# Altium project AGRO_RAK_MK3.PrjPcb
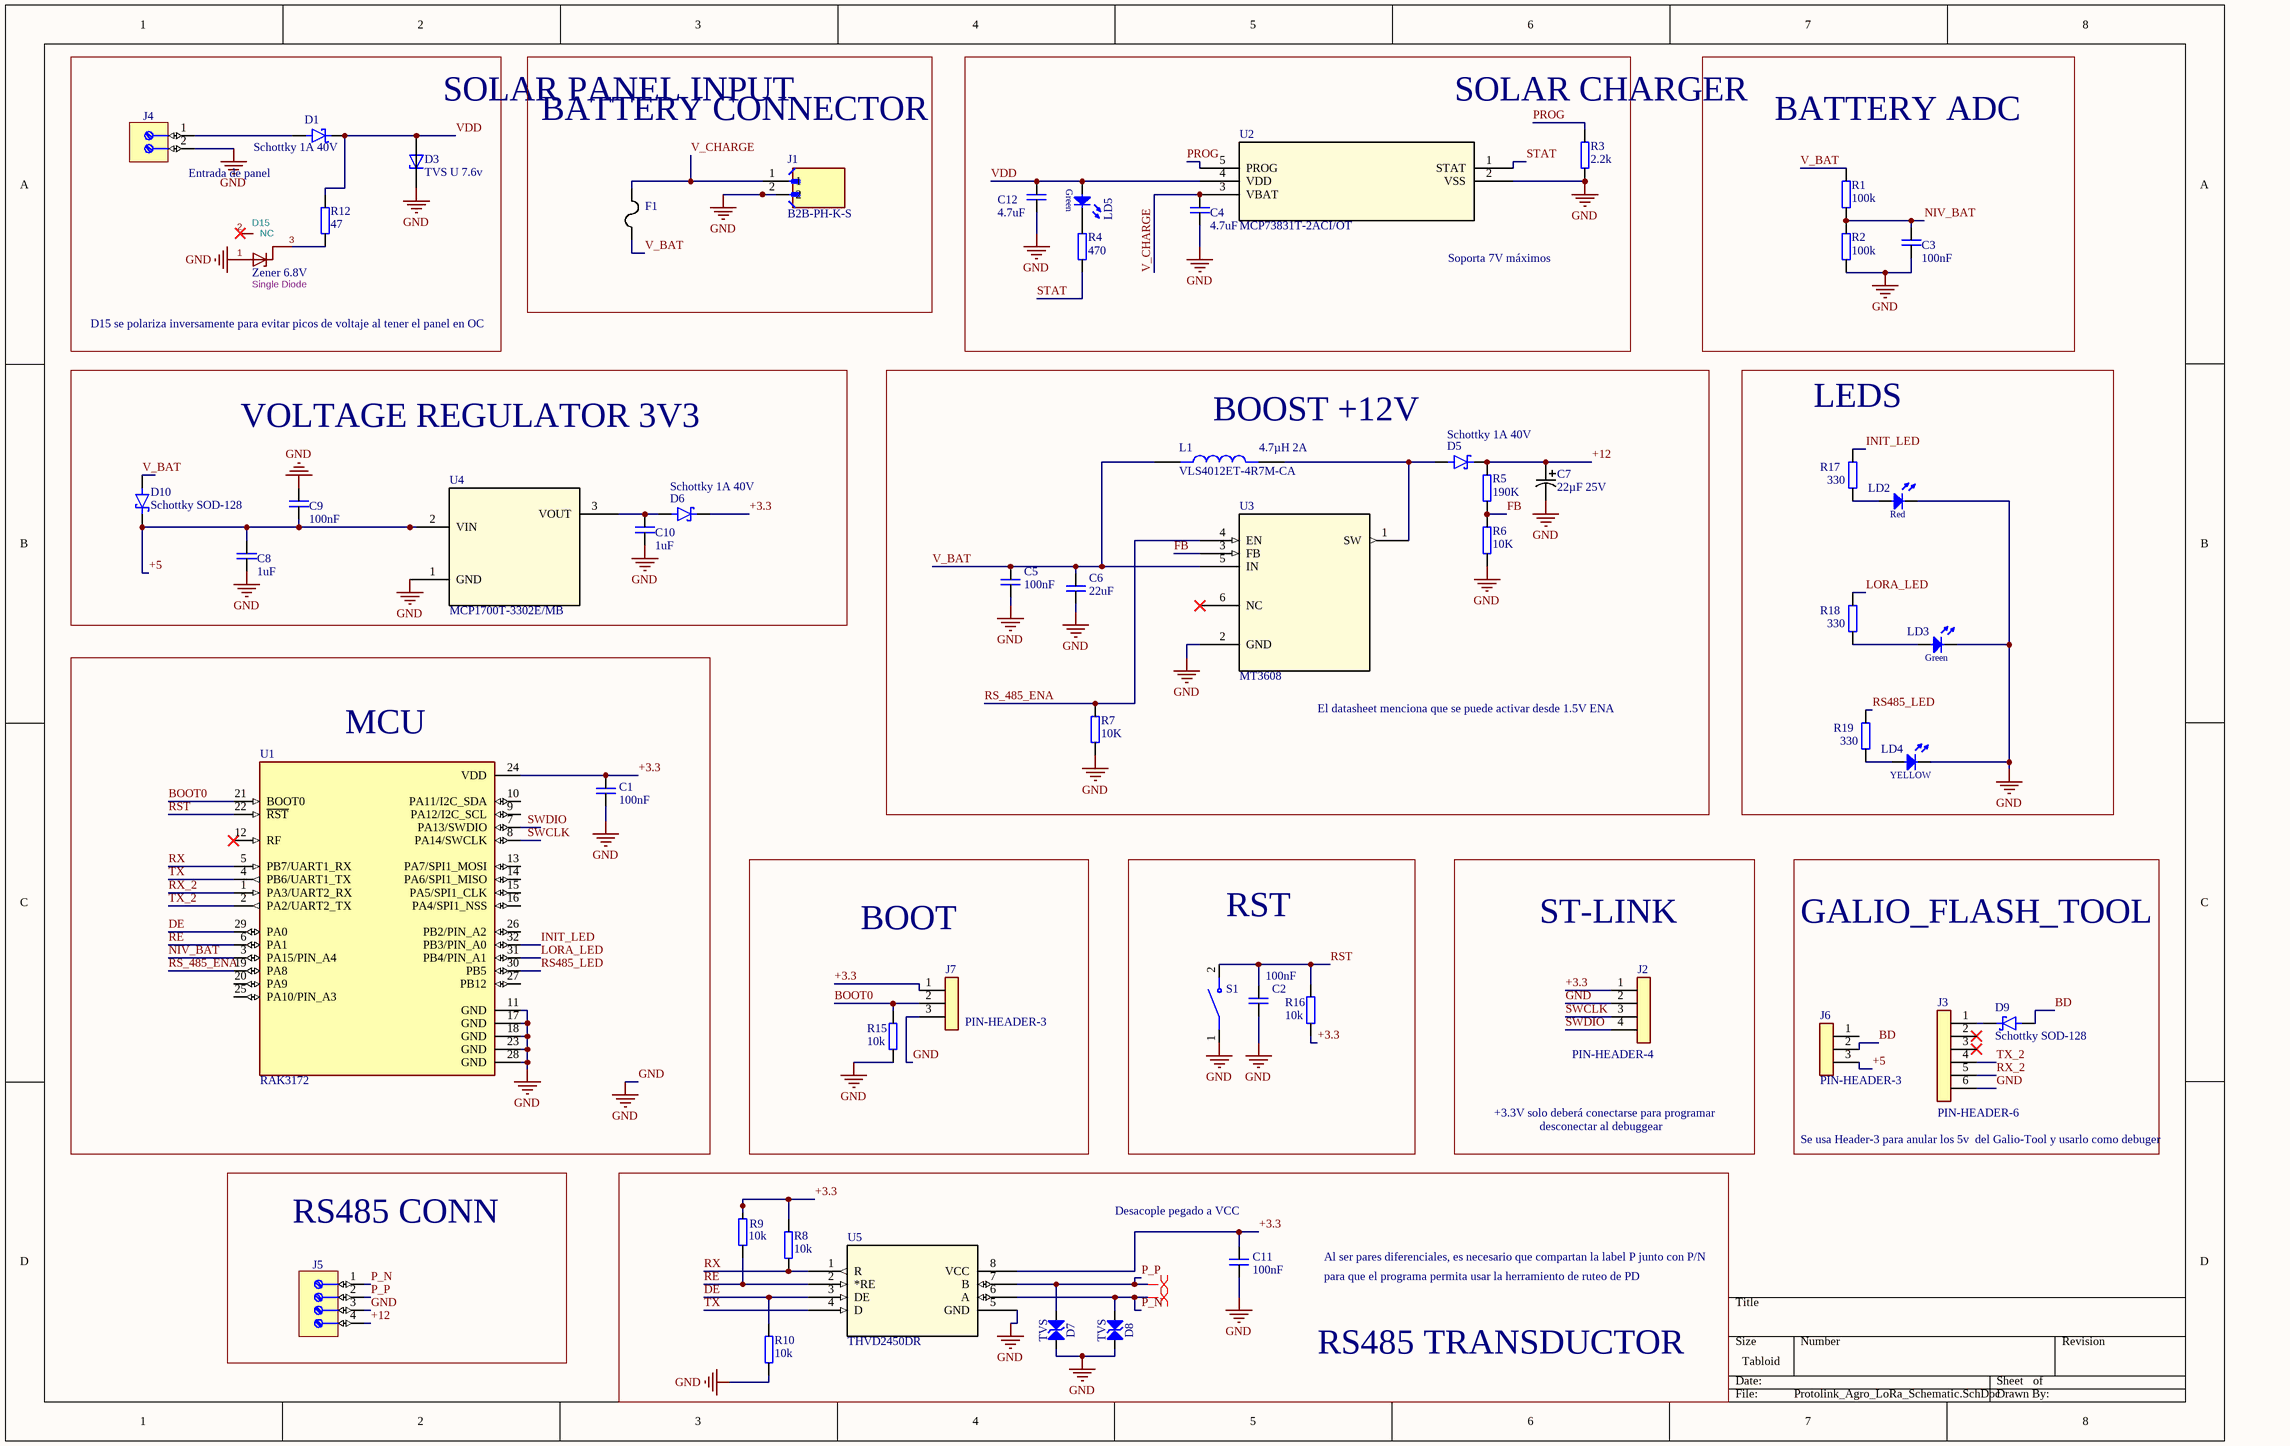
[diagram p0: Protolink_Agro_LoRa_Schematic.SchDoc]
1 sheet, 56 parts. Net scope: global (net labels, ports and power ports of the same name join across sheets).
Board file: Protolink_Agro_LoRa.PcbDoc

## Sheet Protolink_Agro_LoRa_Schematic.SchDoc
size Tabloid; SheetNumber: 1; SheetTotal: 1

### Parts
C1  100nF  [CAPC2012X110N]
C2  100nF  [CAPC2012X110N]
C3  100nF  [CAPC2012X110N]
C4  4.7uF  [CAPC2012X110N]
C5  100nF  [CAPC2012X110N]
C6  22uF  [CAPC2012X110N]
C7  22µF 25V  [CAP_EEFK_C_PAN]
C8  1uF  [CAPC2012X110N]
C9  100nF  [CAPC2012X110N]
C10  1uF  [CAPC2012X110N]
C11  100nF  [CAPC2012X110N]
C12  4.7uF  [CAPC2012X110N]
D1  Schottky 1A 40V  [SODFL4725X110N]
D3  TVS U 7.6v  [DIOM4325X250N]
D5  Schottky 1A 40V  [SODFL4725X110N]
D6  Schottky 1A 40V  [SODFL4725X110N]
D7  TVS  [DIOM5126X229N]
D8  TVS  [DIOM5126X229N]
D9  Schottky SOD-128  [SODFL4725X110N]
D10  Schottky SOD-128  [SODFL4725X110N]
D15  Zener 6.8V  value Single Diode  [SOT-23]
F1  (no value)  [FUSE_MF-MSMF07524-2_BRN]
J1  B2B-PH-K-S  [JST_B2B-PH-K-S]
J2  PIN-HEADER-4  [PIN-HEADER-4-MALE]
J3  PIN-HEADER-6  [PIN-HEADER-6-FEMALE]
J4  TRT2  [TRT_2_KF301]  (value not drawn)
J5  TRT4  [TRT_4_ KF301]  (value not drawn)
J6  PIN-HEADER-3  [PIN-HEADER-3-MALE]
J7  PIN-HEADER-3  [PIN-HEADER-3-MALE]
L1  VLS4012ET-4R7M-CA  [IND_VLS4012ET-4R7M-CA]
LD2  (no value)  [LEDC2012X70N]
LD3  (no value)  [LEDC2012X70N]
LD4  (no value)  [LEDC2012X70N]
LD5  (no value)  [LEDC2012X70N]
R1  100k  [RESC2013X84N]
R2  100k  [RESC2013X84N]
R3  2.2k  [RESC2013X84N]
R4  470  [RESC2013X84N]
R5  190K  [RESC2013X84N]
R6  10K  [RESC2013X84N]
R7  10K  [RESC2013X84N]
R8  10k  [RESC2013X84N]
R9  10k  [RESC2013X84N]
R10  10k  [RESC2013X84N]
R12  47  [RESC2013X84N]
R15  10k  [RESC2013X84N]
R16  10k  [RESC2013X84N]
R17  330  [RESC2013X84N]
R18  330  [RESC2013X84N]
R19  330  [RESC2013X84N]
S1  (no value)  [SWITCH-SMD-4x3mm]
U1  RAK3172  [XCVR_RAK3172]
U2  MCP73831T-2ACI/OT  [SOT-23-5_MC_MCH-M]
U3  MT3608  [TSOT23-6SOT23-6_AER]
U4  MCP1700T-3302E/MB  [SOT-89_3MC_MCH]
U5  THVD2450DR  [SOIC8-N_MC]

### Blocks framed on the sheet
SOLAR PANEL INPUT: D1 D3 D15 J4 R12
BATTERY CONNECTOR: F1 J1
SOLAR CHARGER: C4 C12 LD5 R3 R4 U2
BATTERY ADC: C3 R1 R2
VOLTAGE REGULATOR 3V3: C8-C10 D6 D10 U4
BOOST +12V: C5-C7 D5 L1 R5-R7 U3
LEDS: LD2-LD4 R17-R19
MCU: C1 U1
BOOT: J7 R15
RST: C2 R16 S1
ST-LINK: J2
GALIO_FLASH_TOOL: D9 J3 J6
RS485 CONN: J5
RS485 TRANSDUCTOR: C11 D7 D8 R8-R10 U5

### Nets
GND: C1.1 C2.1 C3.1 C4.1 C5.1 C6.1 C7.2 C8.1 C9.2 C10.1 C11.1 C12.1 D3.C D7.1(C) D8.1(C) D15.1(A) J1.2 J2.2 J3.6 J4.2 J5.3 J7.3 LD2.1(C) LD3.1(C) LD4.1(C) R2.1 R3.1 R6.1 R7.1 R10.1 R15.1 S1.1 U1.11(GND) U1.17(GND) U1.18(GND) U1.23(GND) U1.28(GND) U2.2(VSS) U3.2(GND) U4.1(GND) U5.5(GND)
+3.3: C1.2 C11.2 D6.1(K) J2.1 J7.1 R8.2 R9.2 R16.1 U1.24(VDD) U5.8(VCC)
+5: C8.2 C9.1 D10.1(K) J6.3 U4.2(VIN)
+12: C7.1 D5.1(K) J5.4 R5.2
BD: D9.2(A) J6.2
BOOT0: J7.2 R15.2 U1.21(BOOT0)
DE: R10.2 U1.29(PA0) U5.3(DE)
FB: R5.1 R6.2 U3.3(FB)
INIT_LED: R17.2 U1.32(PB3/PIN_A0)
LORA_LED: R18.2 U1.31(PB4/PIN_A1)
NIV_BAT: C3.2 R1.1 R2.2 U1.3(PA15/PIN_A4)
P_N: D8.2(A) J5.1 U5.6(A)
P_P: D7.2(A) J5.2 U5.7(B)
PROG: R3.2 U2.5(PROG)
RE: R9.1 U1.6(PA1) U5.2(*RE)
RS485_LED: R19.2 U1.30(PB5)
RS_485_ENA: R7.2 U1.19(PA8) U3.4(EN)
RST: C2.2 R16.2 S1.2 U1.22(~{RST})
RX: R8.1 U1.5(PB7/UART1_RX) U5.1(R)
RX_2: J3.5 U1.1(PA3/UART2_RX)
STAT: R4.1 U2.1(STAT)
SWCLK: J2.3 U1.8(PA14/SWCLK)
SWDIO: J2.4 U1.7(PA13/SWDIO)
TX: U1.4(PB6/UART1_TX) U5.4(D)
TX_2: J3.4 U1.2(PA2/UART2_TX)
V_BAT: C5.2 C6.2 D10.2(A) F1.1 L1.1 R1.2 U3.5(IN)
V_CHARGE: C4.2 F1.2 J1.1 U2.3(VBAT)
VDD: C12.2 D1.1(K) D3.A LD5.2(A) R12.2 U2.4(VDD)
NetC10_2: C10.2 D6.2(A) U4.3(VOUT)
NetD1_2: D1.2(A) J4.1
NetD5_2: D5.2(A) L1.2 U3.1(SW)
NetD9_1: D9.1(K) J3.1
NetD15_3: D15.3(C) R12.1
NetLD2_2: LD2.2(A) R17.1
NetLD3_2: LD3.2(A) R18.1
NetLD4_2: LD4.2(A) R19.1
NetLD5_1: LD5.1(C) R4.2

Not connected (* = marked no-connect by the designer): D15 2(NC)*; J3 2* 3*; J6 1; U1 9(PA12/I2C_SCL) 10(PA11/I2C_SDA) 12(RF)* 13(PA7/SPI1_MOSI) 14(PA6/SPI1_MISO) 15(PA5/SPI1_CLK) 16(PA4/SPI1_NSS) 20(PA9) 25(PA10/PIN_A3) 26(PB2/PIN_A2) 27(PB12); U3 6(NC)*

### Layout directives
differential pair: P_N, P_P

### Notes on the sheet
- (near J4) Entrada de panel
- Soporta 7V máximos
- D15 se polariza inversamente para evitar picos de voltaje al tener el panel en OC
- (near L1) 4.7µH 2A
- El datasheet menciona que se puede activar desde 1.5V ENA
- +3.3V solo deberá conectarse para programar
- desconectar al debuggear
- Se usa Header-3 para anular los 5v  del Galio-Tool y usarlo como debuger
- (near C11) Desacople pegado a VCC
- Al ser pares diferenciales, es necesario que compartan la label P junto con P/N
- para que el programa permita usar la herramiento de ruteo de PD
- (in symbol LED Green 0805) Green
- (in symbol LED Red 0805) Red
- (in symbol LED Yellow 0805) YELLOW

### Library data of the parts
C1-C6 C8-C12 = C0805C125K4RACTU: CAPACITOR, 0805; MF: KEMET; SnapEDA_Link: https://www.snapeda.com/parts/C0805C125K4RACTU/Kemet/view-part/?ref=snap; Package: 805-2 KEMET; Value: *; MP: C0805C125K4RACTU; Check_prices: https://www.snapeda.com/parts/C0805C125K4RACTU/Kemet/view-part/?ref=eda
C7 = EEE-FK1E220AR: Capacitor electrolítico aluminio SMD; Manufacturer_Name: Panasonic; Copyright: Copyright (C) 2026 Ultra Librarian. All rights reserved.; Manufacturer_Part_Number: EEE-FK1E220AR
D1 D5 D6 D9 D10 = PMEG4020ETP,115: Diode Schottky 40V 2A Surface Mount SOD-128/CFP5; MF: Nexperia USA; SnapEDA_Link: https://www.snapeda.com/parts/PMEG4020ETP,115/Nexperia/view-part/?ref=snap; Package: CFP5-2 Nexperia USA Inc.; Value: *; MP: PMEG4020ETP,115; Check_prices: https://www.snapeda.com/parts/PMEG4020ETP,115/Nexperia/view-part/?ref=eda
D3 = SMAJ11A: 11 TVS Diode Surface Mount DO-214AC (SMA); MF: Bourns; SnapEDA_Link: https://www.snapeda.com/parts/SMAJ11A/Bourns/view-part/?ref=snap; Package: DO-214 Bourns; Value: *; MP: SMAJ11A; Check_prices: https://www.snapeda.com/parts/SMAJ11A/Bourns/view-part/?ref=eda
D7 D8 = Diode TVS Bi-Directional: Transient Voltage Suppressor Diode (Bi-Directional)
D15 = Zener-Diode_NC: ki_keywords: Zener Dual Diode Common Anode; ki_description: Zener Dual Diode Common Anode
F1 = MF-MSMF07524-2: Fuse; Manufacturer_Name: Bourns Electronics; Manufacturer_Part_Number: MF-MSMF075/24-2; Copyright: Copyright (C) 2026 Ultra Librarian. All rights reserved.
J1 = B2B-PH-K-S: Connector Header Through Hole 2 position 0.079 (2.00mm); MF: JST Sales America Inc.; SnapEDA_Link: https://www.snapeda.com/parts/B2B-PH-K-S/JST/view-part/?ref=snap; Package: None; Value: *; MP: B2B-PH-K-S; Check_prices: https://www.snapeda.com/parts/B2B-PH-K-S/JST/view-part/?ref=eda
J2 = PIN-HEADER-4: MP: MTSW-104-06-T-S-100; Price: None; Availability: Unavailable; Package: None; Value: *
J3 = PIN-HEADER-6: MP: MTSW-106-06-T-S-100; Package: None; Price: None; Availability: Unavailable; Value: *
J4 = TRT_2: Terminal Block, 2 Positions, Screw Connection
J5 = TRT_4
J6 J7 = PIN-HEADER-3: MP: MTSW-103-06-T-S-190; Value: *; Availability: Unavailable; Package: None; Price: None
L1 = VLS4012ET-4R7M-CA: 4.7 µH Shielded Drum Core, Wirewound Inductor 1.9 A 118mOhm Max Nonstandard; MF: TDK; SnapEDA_Link: https://www.snapeda.com/parts/VLS4012ET-4R7M-CA/TDK/view-part/?ref=snap; Package: NON STANDARD-2 TDK; Value: *; MP: VLS4012ET-4R7M-CA; Check_prices: https://www.snapeda.com/parts/VLS4012ET-4R7M-CA/TDK/view-part/?ref=eda
LD2 = LED Red 0805
LD3 LD5 = LED Green 0805
LD4 = LED Yellow 0805
R1-R10 R12 R15-R19 = RES
S1 = SWITCH-SMD-4x3mm: 50mA 4mm 100MÎ© 100,000 Times 12V 160gf 3mm 2mm Round Button Vertical welding SPST SMD Tactile Switches ROHS; MF: Xunpu; MP: TS-1088-AR02016; SnapEDA_Link: https://www.snapeda.com/parts/TS-1088-AR02016/Xunpu/view-part/?ref=snap; Package: Package; Value: *; Check_prices: https://www.snapeda.com/parts/TS-1088-AR02016/Xunpu/view-part/?ref=eda
U1 = RAK3172: RAK3172 is a low-power long-range transceiver module based on the STM32WLE5CC chip. It provides an easy-to-use, small-size, low-power solution for long range wireless data applications; MF: Shenzhen RAKwireless Technology Co.,Ltd.; SnapEDA_Link: https://www.snapeda.com/parts/RAK3172/Shenzhen+RAKwireless+Technology+Co.%252CLtd./view-part/?ref=snap; Package: Package; Value: *; MP: RAK3172; Check_prices: https://www.snapeda.com/parts/RAK3172/Shenzhen+RAKwireless+Technology+Co.%252CLtd./view-part/?ref=eda
U2 = MCP73831T-2ACIOT: Series Single-Cell Li-Ion/Li-Polymer Battery Charge Controller; Manufacturer_Name: Microchip; Copyright: Copyright (C) 2025 Ultra Librarian. All rights reserved.; Manufacturer_Part_Number: MCP73831T-2ACI/OT; RefDes: RefDes; Type: Type
U3 = MT3608: DC-DC step-up; Manufacturer_Name: Aerosemi; Copyright: Copyright (C) 2025 Ultra Librarian. All rights reserved.; Manufacturer_Part_Number: MT3608; RefDes: RefDes; Type: Type
U4 = MCP1700T-3302EMB: Linear Voltage Regulators; Manufacturer_Name: Microchip; Copyright: Copyright (C) 2026 Ultra Librarian. All rights reserved.; Manufacturer_Part_Number: MCP1700T-3302E/MB; RefDes: RefDes; Type: Type
U5 = THVD2450DR: Transceiver Half RS422, RS485 SOIC-8; Manufacturer_Name: Texas Instruments; Copyright: Copyright (C) 2025 Ultra Librarian. All rights reserved.; Manufacturer_Part_Number: THVD2450DR; RefDes: RefDes; Type: Type